# Altium schematic sheet 行天宮-流亡暗道-裂界裝置.SchDoc
size A3
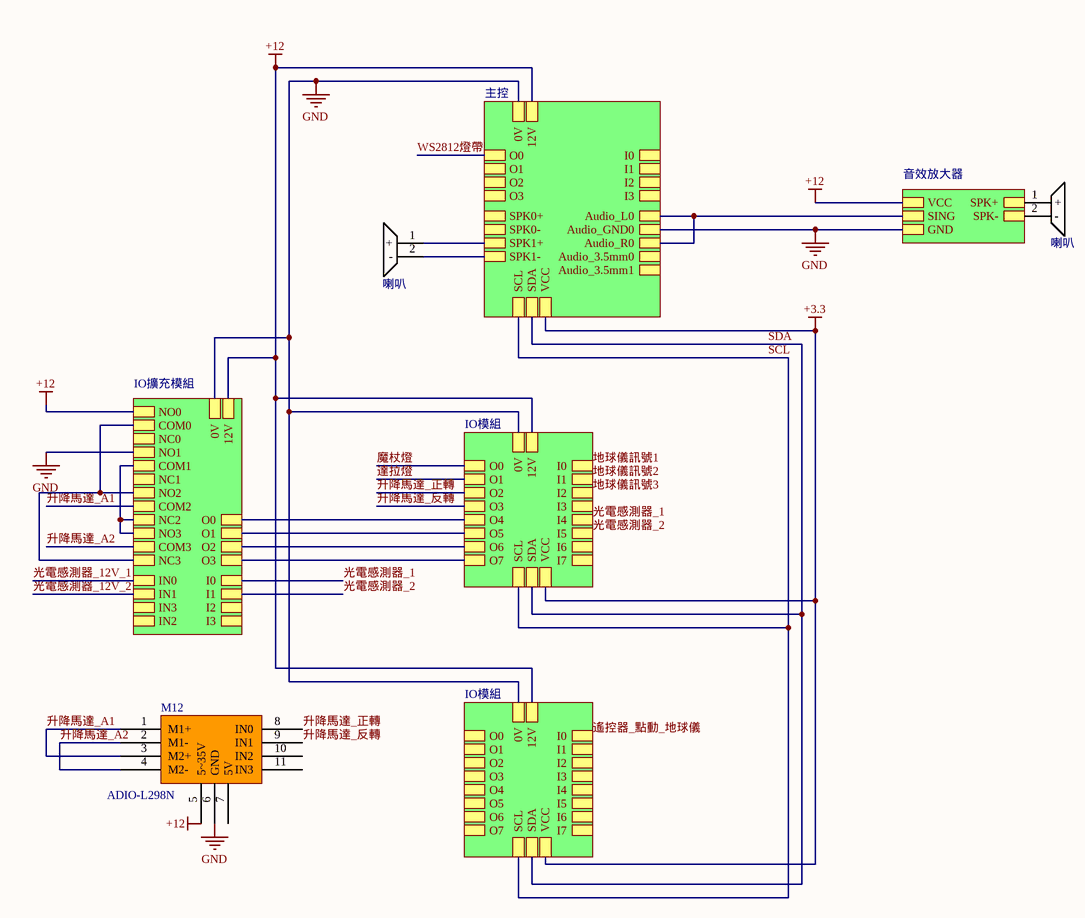
[diagram p0: 行天宮-流亡暗道-裂界裝置.SchDoc]

## Parts
B10  喇叭  [Buzzer_12085]
B13  喇叭  [Buzzer_12085]
M12  ADIO-L298N  [L298N]

## Sub-sheets
IO擴充模組 = 輸出輸入擴充模組_20240808.SchDoc: O1, O2, I2, I3, I1, O3, O0, I0, 0V, 12V, COM2, NO0, NC3, NO2, NC2, NO3, COM0, NC0, COM3, NC1, COM1, NO1, IN0, IN1, IN3, IN2
IO模組 = IO模組_MCP23017_20240812.SchDoc: O5, O7, O3, I6, I7, O4, O1, I0, I1, I2, I3, I4, I5, O6, O2, O0, VCC, 12V, 0V, SCL, SDA
IO模組 = IO模組_MCP23017_20240812.SchDoc: O5, O7, O3, I6, I7, O4, O1, I0, I1, I2, I3, I4, I5, O6, O2, O0, VCC, 12V, 0V, SCL, SDA
主控 = ESP32主控_20240812.SchDoc: 12V, SDA, VCC, 0V, SCL, O3, O2, O1, O0, I3, I2, I1, I0, SPK0+, Audio_3.5mm1, Audio_L0, SPK0-, Audio_R0, SPK1+, SPK1-, Audio_3.5mm0, Audio_GND0
音效放大器 = File Name: VCC, SING, GND, SPK-, SPK+

## Nets
+3.3: sheet 主控/VCC, sheet IO模組/VCC, sheet IO模組/VCC
+12: M12.5(5~35V) ; sheet 主控/12V, sheet IO模組/12V, sheet IO模組/12V, sheet 音效放大器/VCC, sheet IO擴充模組/12V, sheet IO擴充模組/NO0
GND: M12.6(GND) ; sheet 主控/0V, sheet 主控/Audio_GND0, sheet IO模組/0V, sheet IO模組/0V, sheet 音效放大器/GND, sheet IO擴充模組/0V, sheet IO擴充模組/NO1
SCL: sheet 主控/SCL, sheet IO模組/SCL, sheet IO模組/SCL
SDA: sheet 主控/SDA, sheet IO模組/SDA, sheet IO模組/SDA
WS2812燈帶: sheet 主控/O0
光電感測器_1: sheet IO模組/I4, sheet IO擴充模組/I0
光電感測器_2: sheet IO模組/I5, sheet IO擴充模組/I1
光電感測器_12V_1: sheet IO擴充模組/IN0
光電感測器_12V_2: sheet IO擴充模組/IN1
升降馬達_A1: M12.1(M1+) M12.3(M2+) ; sheet IO擴充模組/COM2
升降馬達_A2: M12.2(M1-) M12.4(M2-) ; sheet IO擴充模組/COM3
升降馬達_反轉: M12.9(IN1) ; sheet IO模組/O3
升降馬達_正轉: M12.8(IN0) ; sheet IO模組/O2
地球儀訊號1: sheet IO模組/I0
地球儀訊號2: sheet IO模組/I1
地球儀訊號3: sheet IO模組/I2
達拉燈: sheet IO模組/O1
遙控器_點動_地球儀: sheet IO模組/I0
魔杖燈: sheet IO模組/O0
NetB10_1: B10.1(+) ; sheet 音效放大器/SPK+
NetB10_2: B10.2(-) ; sheet 音效放大器/SPK-
NetB13_1: B13.1(+) ; sheet 主控/SPK1+
NetB13_2: B13.2(-) ; sheet 主控/SPK1-
(unnamed): sheet 主控/Audio_L0, sheet 主控/Audio_R0, sheet 音效放大器/SING
(unnamed): sheet IO模組/O5, sheet IO擴充模組/O1
(unnamed): sheet IO模組/O7, sheet IO擴充模組/O3
(unnamed): sheet IO模組/O4, sheet IO擴充模組/O0
(unnamed): sheet IO模組/O6, sheet IO擴充模組/O2
(unnamed): sheet IO擴充模組/NC3, sheet IO擴充模組/NO2, sheet IO擴充模組/COM0
(unnamed): sheet IO擴充模組/NC2, sheet IO擴充模組/NO3, sheet IO擴充模組/COM1

Not connected (* = marked no-connect by the designer): M12 7(5V) 10(IN2) 11(IN3)

## Library data of the parts
B10 B13 = Buzzer: 無源蜂鳴器
M12 = L298N: 步進馬達控制、馬達正反轉模組; #1: 當驅動電壓高於12V，小於等於24V時，必須拔除板載5V輸出使能的跳線帽。然後在5V輸出埠外部接入5V電壓對L298N內部邏輯電路供電; ComponentLink1Description: datasheet; ComponentLink1URL: https://shop.cpu.com.tw/product/46920/info/